# Altium schematic sheet Beam_Amp.SchDoc
size Tabloid
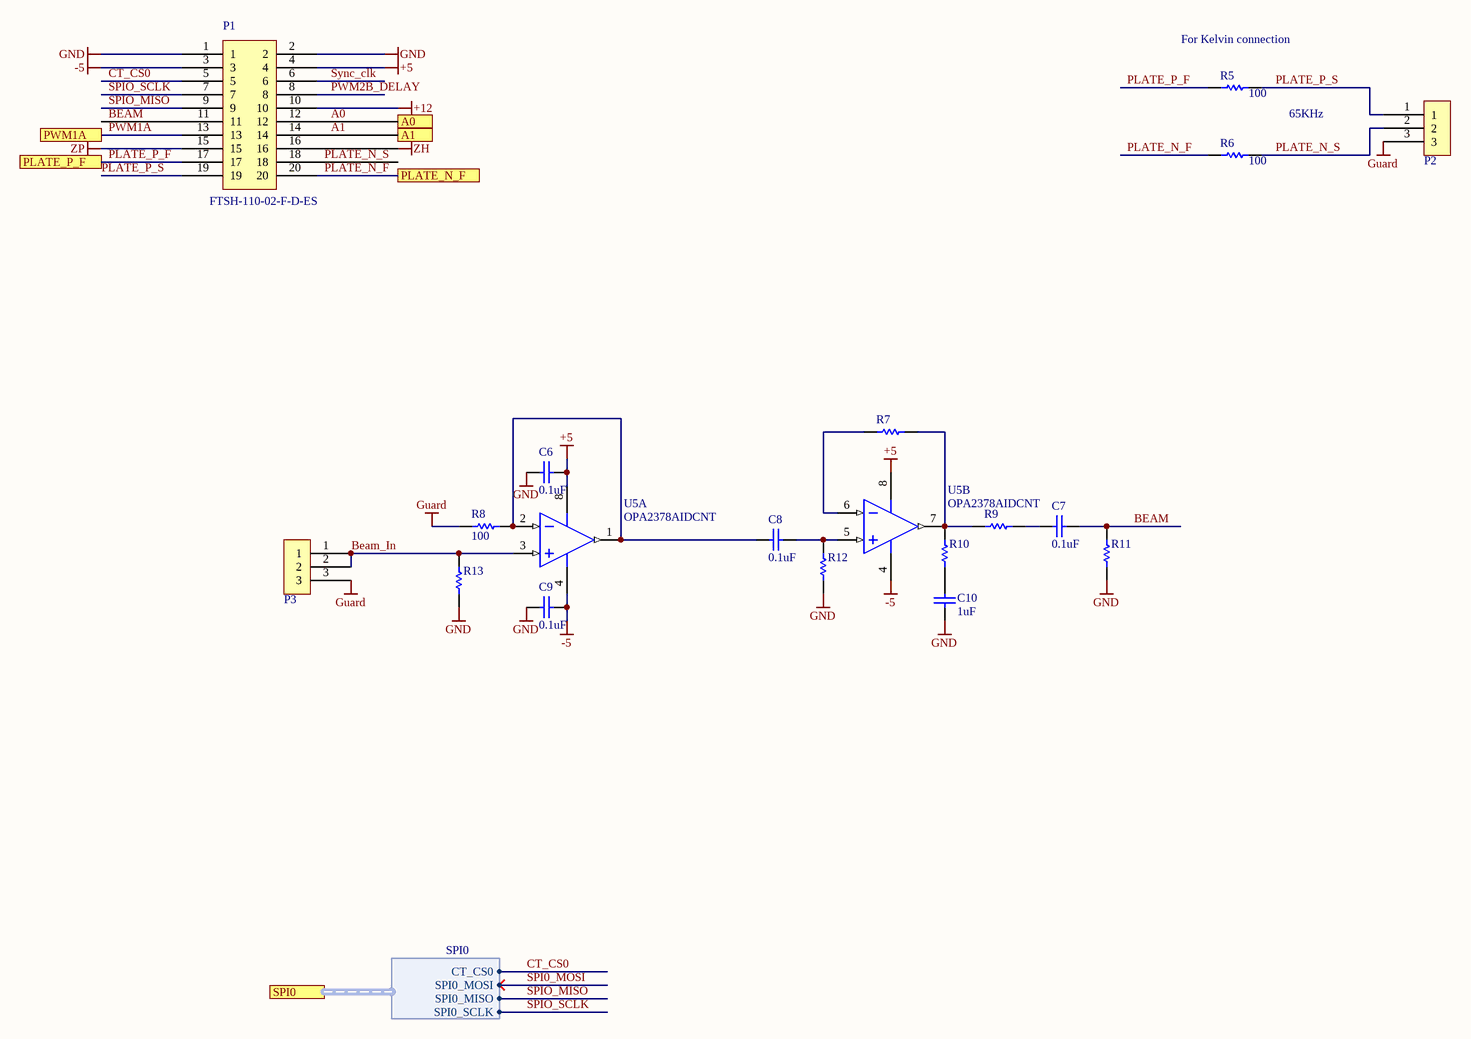
[diagram p0: Beam_Amp.SchDoc]

## Parts
C6  0.1uF  [CAPC0402(1005)60_L]
C7  0.1uF  [CAPC0402(1005)60_L]
C8  0.1uF  [CAPC0402(1005)60_L]
C9  0.1uF  [CAPC0402(1005)60_L]
C10  1uF  [CAPC0402(1005)60_L]
P1  FTSH-110-02-F-D-ES  [FTSH-110-02-F-D-ES]
P2  Triax_Conn  [Triax_Conn]  (value not drawn)
P3  Triax_Conn  [Triax_Conn]  (value not drawn)
R5  100  [RESC0805(2012)_L]
R6  100  [RESC0805(2012)_L]
R7  (no value)  [RESC0402(1005)_M]
R8  100  [RESC0402(1005)_M]
R9  (no value)  [RESC0402(1005)_M]
R10  (no value)  [RESC0402(1005)_M]
R11  (no value)  [RESC0402(1005)_M]
R12  (no value)  [RESC0402(1005)_M]
R13  (no value)  [RESC0402(1005)_M]
U5  OPA2378AIDCNT  [DCN0008A_M]  (parts A,B of 2)

## Ports
A0, A1, PLATE_N_F, PLATE_P_F, PWM1A, SPI0 (harness SPI0)

## Harnesses
SPI0: CT_CS0, SPI0_MOSI, SPI0_MISO, SPI0_SCLK

## Nets
+5: C6.2 P1.4 U5.8(V+)
+12: P1.10
-5: C9.2 P1.3 U5.4(V-)
GND: C6.1 C9.1 C10.1 P1.1 P1.2 R11.2 R12.2 R13.1
Guard: P2.3 P3.3 R8.2
ZH: P1.16
ZP: P1.15
A0: P1.12 ; port A0
A1: P1.14 ; port A1
BEAM: C7.2 P1.11 R11.1
Beam_In: P3.1 P3.2 R13.2 U5.3(IN_A+)
CT_CS0: P1.5 ; port SPI0.CT_CS0
PLATE_N_F: P1.20 R6.2 ; port PLATE_N_F
PLATE_N_S: P1.18 P2.2 R6.1
PLATE_P_F: P1.17 R5.2 ; port PLATE_P_F
PLATE_P_S: P1.19 P2.1 R5.1
PWM1A: P1.13 ; port PWM1A
PWM2B_DELAY: P1.8
SPI0_MOSI: port SPI0.SPI0_MOSI
SPIO_MISO: P1.9 ; port SPI0.SPI0_MISO
SPIO_SCLK: P1.7 ; port SPI0.SPI0_SCLK
Sync_clk: P1.6
NetC7_1: C7.1 R9.1
NetC8_1: C8.1 R8.1 U5.1(OUT_A) U5.2(IN_A-)
NetC8_2: C8.2 R12.1 U5.5(IN_B+)
NetC10_2: C10.2 R10.2
NetR7_1: R7.1 R9.2 R10.1 U5.7(OUT_B)
NetR7_2: R7.2 U5.6(IN_B-)

## Notes on the sheet
- (near R5) For Kelvin connection
- 65KHz
- Title
- Size:
- Date:
- Tabloid
- Number:
- Time:
- Revision:
- Sheet
- of
- ZLS Corporation
- 7801 North Lamar Blvd.
- Suite E-184
- Austin, Texas 78752  USA
- (512) 453-0288
- File:

## Library data of the parts
C6-C10 = CMP-1034-00252-1: CAP CER 0.1UF 10V X7R 0402; Manufacturer: Murata Electronics North America; Manufacturer Part Number: GRM155R71A104KA01D; Tolerance: ±10%; Supplier 1: Digi-Key; Supplier Part Number 1: 490-6321-1-ND; RoHS: RoHS Compliant; Category: Capacitors; Stock 1: 2920395; Pricing 1: 1=0.1, 10=0.014, 100=0.0063, 500=0.00446, 1000=0.00351, 2500=0.00319, 5000=0.00293 (USD); Packaging: Cut Tape (CT); Part Status: Active; Voltage - Rated: 10V; Temperature Coefficient: X7R; Operating Temperature: -55°C ~ 125°C; Features: -; Ratings: -; Applications: General Purpose; Mounting Type: Surface Mount, MLCC; Package / Case: 0402 (1005 Metric); Size / Dimension: 0.039" L x 0.020" W (1.00mm x 0.50mm); Height - Seated (Max): -; Thickness (Max): 0.022" (0.55mm); Lead Spacing: -; ComponentLink1URL: http://www.murata.com/~/media/webrenewal/support/library/catalog/products/capacitor/mlcc/c02e.ashx?la=en-us; ComponentLink1Description: http://www.murata.com/~/media/webrenewal/support/library/catalog/products/capacitor/mlcc/c02e.ashx?la=en-us
R5 R6 = CMP-1013-00215-1: RES SMD 100 OHM JUMPER 1/8W 0805
R7-R13 = CMP-1011-00463-1
U5 = CMP-0272-01124-3: Low-Noise, 900 kHz, RRIO, Precision Operational Amplifier, Zero-Drift Series, 2.2 to 5.5 V, -40 to 125 degC, 8-pin SOP (DCN8), Green (RoHS & no Sb/Br); Manufacturer: Texas Instruments; Number of Channels: 2; Offset Drift(Typ)(uV/C): 0.25; Total Supply Voltage(Min)(+5V is 5, +/-5V is 10): 2.2; Vn at 1kHz(Typ)(nV/rtHz): 20; Iq per channel(Max)(mA): 0.15; Total Supply Voltage(Max)(+5V is 5, +/-5V is 10): 5.5; Sub Family: Low Offset Voltage Amplifier (<=500uV), Low Power Amp (<=500uA), Low Supply Voltage Amplifier (<=2.7V), Precision Amplifier, Zero Drift Precision Amplifier; IIB(Max)(pA): 550; Vio (25C)(Max)(mV): 0.07; CMRR(Min)(dB): 100; Slew Rate(Typ)(V/us): 0.4; PartNumber: OPA2378AIDCNT; DatasheetVersion: SBOS417D; ComponentLink2Description: Datasheet; ComponentLink3URL: http://www.ti.com/lit/ml/mpds099c/mpds099c.pdf; ComponentLink2URL: http://www.ti.com/general/docs/lit/getliterature.tsp?genericPartNumber=OPA2378&fileType=pdf; PackageReference: DCN0008A; PackageDescription: 8-Pin Plastic Small Outline, Body 1.6 x 2.9 mm, Pitch 0.65 mm; Code_JEDEC: MO-178; PackageVersion: 4202106/D, 11/2009; ComponentLink3Description: Package Specification; Eco-Plan: Green (RoHS & no Sb/Br); ComponentLink1Description: Manufacturer URL; Mounting Technology: Surface Mount; ComponentLink1URL: http://www.ti.com/; PartId: 1